# EAGLE design SPECTROMETER (EAGLE 7.3.0)
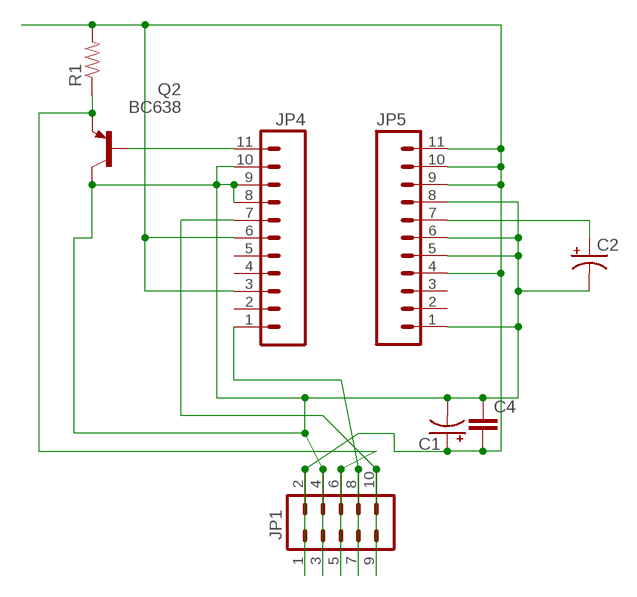
[diagram p0: schematic, sheet 1]

## Parts
C1  CAP_POLPTH1  [CPOL-RADIAL-100UF-25V]
C2  CAP_POLPTH1  [CPOL-RADIAL-100UF-25V]
C4  CAPPTH1  [CAP-PTH-5MM]
JP1  M05X2NO_SILK  [2X5_NOSILK]
JP4  M11LOCK  [1X11_LOCK]
JP5  M11LOCK  [1X11_LOCK]
Q2  BC638  [TO92-BCE]
R1  RESISTORKIT  [AXIAL-0.3-KIT]

## Nets
N$2: JP1.9 JP1.10 JP4.7
N$3: C1.1(+) C4.2 JP1.1 JP1.2 JP4.3 JP4.6 JP5.4 JP5.9 JP5.10 JP5.11 R1.P$2
N$4: C2.1(+) JP5.7
N$5: JP1.5 JP1.6 Q2.E R1.P$1
N$6: JP4.11 Q2.B
N$7: JP1.7 JP1.8 JP4.1
N$8: C1.2(-) C2.2(-) C4.1 JP1.3 JP1.4 JP4.8 JP4.9 JP4.10 JP5.1 JP5.5 JP5.6 JP5.8 Q2.C
Unconnected: JP4.2 JP4.4 JP4.5 JP5.2 JP5.3

## Library data of the parts
C1 C2 = SparkFun-Capacitors:CAP_POL: Capacitor Polarized These are standard SMD and PTH capacitors. Normally 10uF, 47uF, and 100uF in electrolytic and tantalum varieties. Always verify the external diameter of the through hole cap, it varies with capacity, voltage, and manufacturer. The EIA devices should be standard.
C4 = SparkFun-Capacitors:CAP: Capacitor Standard 0603 ceramic capacitor, and 0.1" leaded capacitor.
JP1 = SparkFun-Connectors:M05X2: Header 5x2 Standard 10-pin dual row 0.1" header. Commonly used with AVR-ISP. Use with Spark Fun Electronics SKU: PRT-00778
JP4 JP5 = SparkFun-Connectors:M11: Header 11 Standard 11-pin 0.1" header. Use with straight break away headers (SKU : PRT-00116), right angle break away headers (PRT-00553), swiss pins (PRT-00743), machine pins (PRT-00117), and female headers (PRT-00115).
Q2 = transistor-pnp:BC638*: PNP Transistror
R1 = SparkFun-Resistors:RESISTOR: Resistor Basic schematic elements and footprints for 0603, 1206, and PTH resistors.

## Board
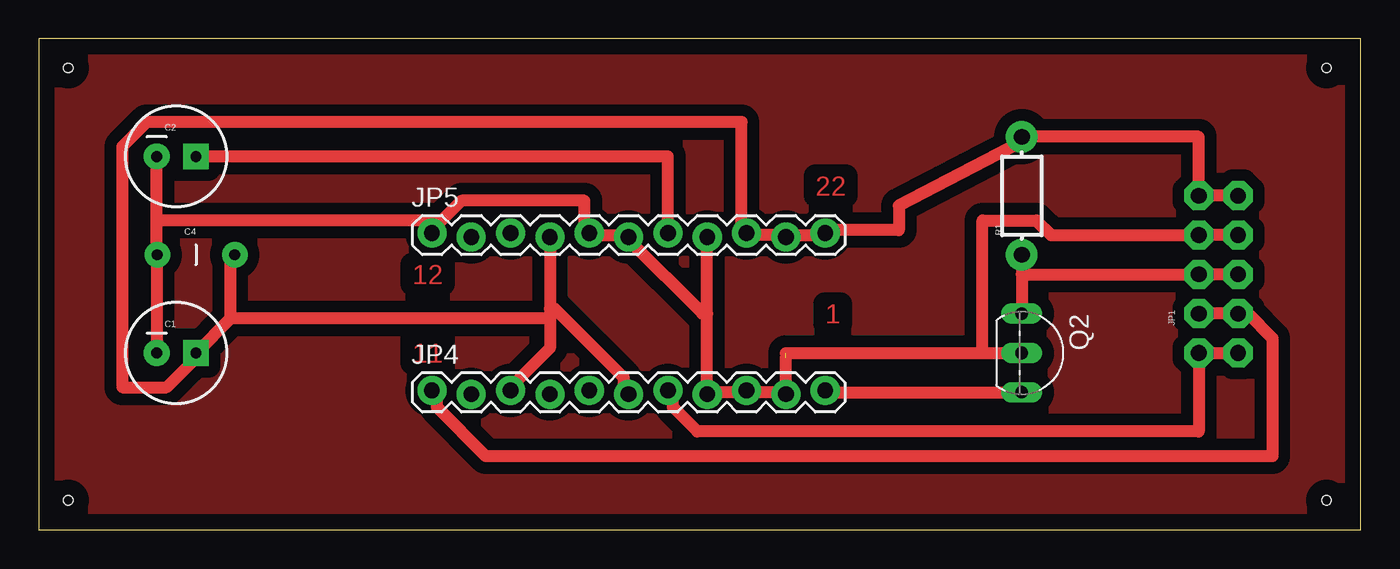
[diagram p1: board, top side]

Size 85.39 x 31.74 mm. Coordinates in mm from the lower left corner, seen from the top.
Outline: 0,0 85.39,0 85.39,31.74 0,31.74 0,0
Copper layers (1*16): Top 0.035mm / dielectric 1.5mm / Bottom 0.035mm
Design rules "default *": minimum track width 30mil, minimum drill 24mil, track to track 30mil, track to pad 30mil, pad to pad 8mil, via to via 8mil, smd to smd 8mil, copper to edge 40mil, drill to drill 8mil, minimum pad ring 10mil, minimum via ring 8mil, stop-mask expansion 4mil, vias tented up to drill 0mil, thermal gap 10mil
Holes 0.6 mm at 1.91,1.9 1.91,29.84 83.19,29.84 83.19,1.9

### Footprints (pad centres in the part's own frame; a part is rotated, then mirrored left to right if it is on the bottom)
CPOL-RADIAL-100UF-25V = drill 0.7 pad 1.651 square: 1 1.27,0 | drill 0.7 pad 1.651: 2 -1.27,0
CAP-PTH-5MM = drill 0.7 pad 1.651: 1 -2.5,0; 2 2.5,0
2X5_NOSILK = drill 1.016 pad 1.88 octagon: 1 -1.27,5.08; 2 1.27,5.08; 3 -1.27,2.54; 4 1.27,2.54; 5 -1.27,0; 6 1.27,0; 7 -1.27,-2.54; 8 1.27,-2.54; 9 -1.27,-5.08; 10 1.27,-5.08
1X11_LOCK = drill 1.016 pad 1.88: 1 0,0.127; 2 2.54,-0.127; 3 5.08,0.127; 4 7.62,-0.127; 5 10.16,0.127; 6 12.7,-0.127; 7 15.24,0.127; 8 17.78,-0.127; 9 20.32,0.127; 10 22.86,-0.127; 11 25.4,0.127
TO92-BCE = drill 0.813 long: B 2.54,0; C 0,0; E -2.54,0
AXIAL-0.3-KIT = drill 1.016 pad 2.032: P$1 -3.81,0; P$2 3.81,0

### Placement (x,y rotation side)
C1  8.89,11.43 0 top
C2  8.89,24.13 0 top
C4  10.16,17.78 0 top
JP1  76.2,16.51 0 top
JP4  25.4,8.89 0 top
JP5  25.4,19.05 0 top
Q2  63.5,11.43 270 top
R1  63.5,21.59 90 top

### Tracks (layer width: path | path; a pad name or v marks a point on that pad's centre or on a via)
N$1
  pour Top (isolate 0.001): 0,31.75 85.09,31.75 85.09,0 0,0 0,31.11
N$2
  Top 0.762: JP4.7 40.64,8.89 40.96,8.57 40.96,7.94 42.55,6.35 74.93,6.35 JP1.9 JP1.10
N$3
  Top 0.762: 12.38,13.65 C1.1 10.16,11.11 8.26,9.21 5.4,9.21 5.4,24.77 6.98,26.35 45.4,26.35 45.4,19.37 JP5.9 45.72,19.05 48.26,19.05 JP5.10 48.58,19.05 50.8,19.05 JP5.11 51.12,19.37 55.56,19.37 55.56,20.96 63.5,25.08 R1.P$2 74.93,25.4 JP1.1 JP1.2 | 12.38,13.65 12.38,17.78 C4.2 | JP5.4 33.02,14.29 | 33.02,14.29 33.02,13.65 | 33.02,13.65 33.02,11.75 30.48,9.21 JP4.3 | JP4.6 38.1,8.89 37.78,9.21 37.78,9.84 33.34,14.29 33.02,14.29 | 33.02,13.65 12.38,13.65
N$4
  Top 0.762: C2.1 40.64,24.13 JP5.7
N$5
  Top 0.762: JP1.6 JP1.5 63.5,16.51 | R1.P$1 63.5,16.51 | 63.5,16.51 Q2.E
N$6
  Top 0.762: Q2.B 50.8,8.89 JP4.11
N$7
  Top 0.762: JP4.1 25.4,8.89 25.72,8.57 25.72,7.94 28.89,4.76 79.69,4.76 79.69,12.38 78.1,13.97 JP1.8 JP1.7
N$8  (1 unrouted)
  Top 0.762: C1.2 7.62,17.78 C4.1 7.62,18.1 7.62,20 | 7.62,20 C2.2 | 7.62,20 25.72,20 JP5.1 25.4,19.37 27.3,21.27 35.24,21.27 35.24,19.37 JP5.5 35.56,19.05 38.1,19.05 JP5.6 38.1,18.73 42.86,13.97 43.18,13.97 | 43.18,13.97 JP4.8 43.18,8.89 45.72,8.89 JP4.9 46.04,8.89 47.94,8.89 JP4.10 48.26,11.11 | 43.18,13.97 JP5.8 | JP1.4 JP1.3 65.41,19.05 64.45,20 60.96,20 60.96,11.43 | 48.26,11.43 60.96,11.43 | 60.96,11.43 Q2.C

### Text on the board
Top: 22 | 12 | 1 | 11